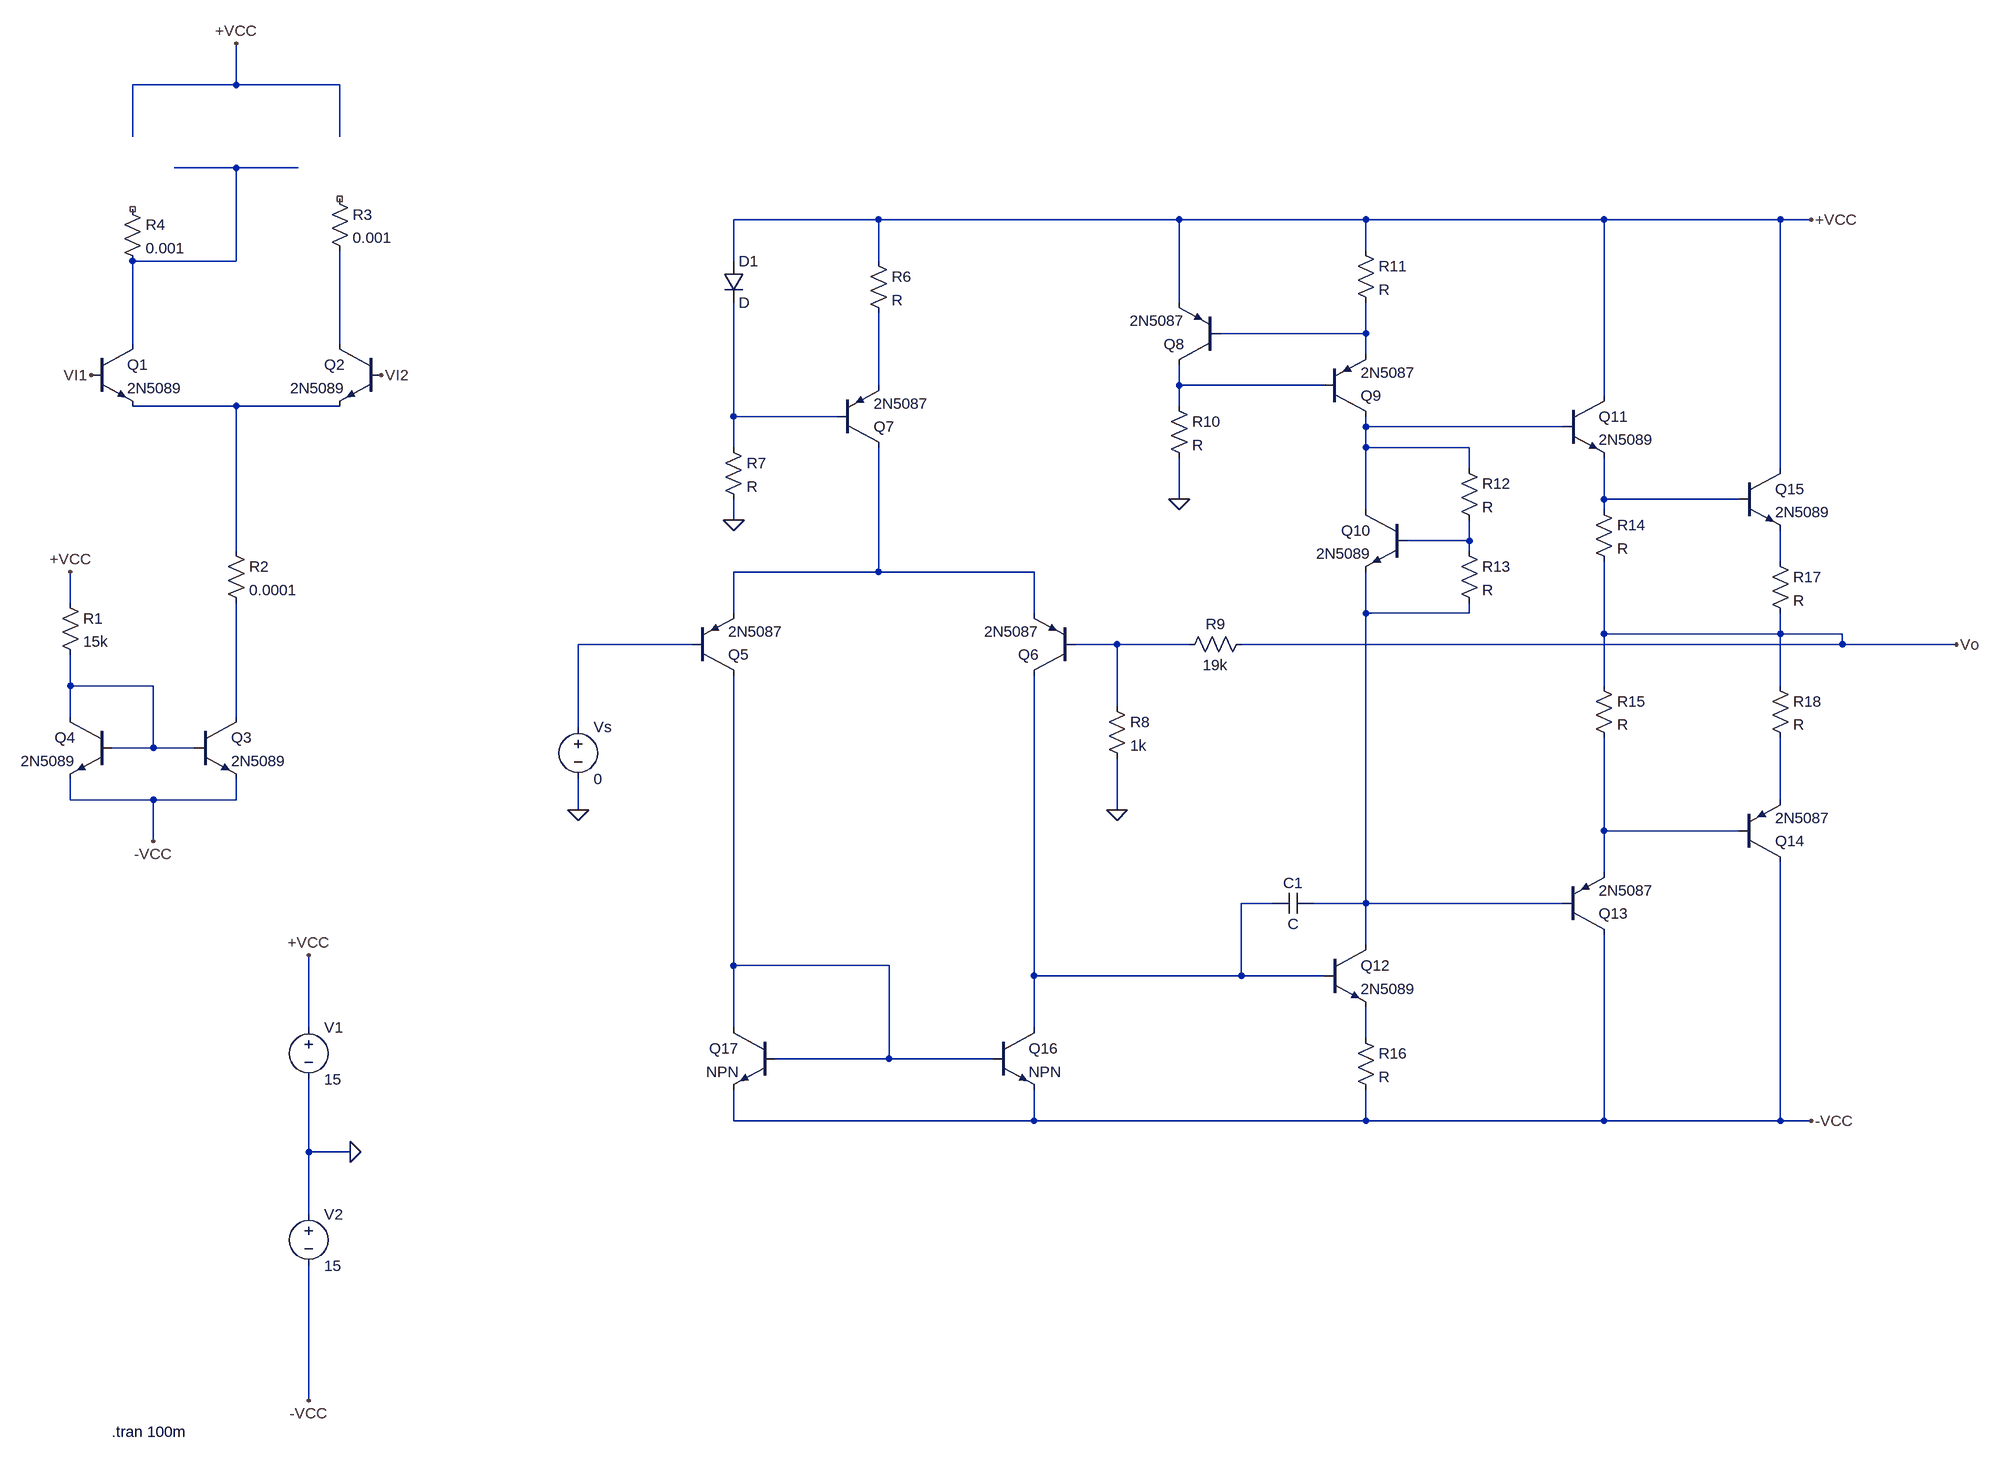
[diagram p0: schematic AmplificadorOperacionalCompleto.asc]
AmplificadorOperacionalCompleto.asc, the LTspice schematic file:
Version 4.1
SHEET 1 4688 1396
WIRE 1072 -736 1072 -800
WIRE 1072 -736 912 -736
WIRE 1232 -736 1072 -736
WIRE 912 -656 912 -736
WIRE 1232 -656 1232 -736
WIRE 1072 -608 976 -608
WIRE 1168 -608 1072 -608
WIRE 2064 -528 1840 -528
WIRE 2528 -528 2064 -528
WIRE 2816 -528 2528 -528
WIRE 3184 -528 2816 -528
WIRE 3456 -528 3184 -528
WIRE 3504 -528 3456 -528
WIRE 2816 -480 2816 -528
WIRE 1072 -464 1072 -608
WIRE 1072 -464 912 -464
WIRE 1840 -464 1840 -528
WIRE 2064 -464 2064 -528
WIRE 2528 -400 2528 -528
WIRE 2816 -352 2816 -400
WIRE 2816 -352 2592 -352
WIRE 912 -336 912 -464
WIRE 1232 -336 1232 -480
WIRE 2816 -320 2816 -352
WIRE 2064 -272 2064 -384
WIRE 2528 -272 2528 -304
WIRE 2752 -272 2528 -272
WIRE 3184 -256 3184 -528
WIRE 1072 -240 912 -240
WIRE 1232 -240 1072 -240
WIRE 2528 -240 2528 -272
WIRE 1840 -224 1840 -400
WIRE 2000 -224 1840 -224
WIRE 2816 -208 2816 -224
WIRE 3120 -208 2816 -208
WIRE 1840 -176 1840 -224
WIRE 2816 -176 2816 -208
WIRE 2976 -176 2816 -176
WIRE 2976 -144 2976 -176
WIRE 3456 -144 3456 -528
WIRE 2528 -96 2528 -160
WIRE 3184 -96 3184 -160
WIRE 3392 -96 3184 -96
WIRE 2816 -80 2816 -176
WIRE 3184 -80 3184 -96
WIRE 1840 -64 1840 -96
WIRE 2976 -32 2976 -64
WIRE 2976 -32 2880 -32
WIRE 1072 -16 1072 -240
WIRE 2976 -16 2976 -32
WIRE 3456 0 3456 -48
WIRE 2064 16 2064 -176
WIRE 2064 16 1840 16
WIRE 2304 16 2064 16
WIRE 816 64 816 16
WIRE 1840 80 1840 16
WIRE 2304 80 2304 16
WIRE 2816 80 2816 16
WIRE 2976 80 2976 64
WIRE 2976 80 2816 80
WIRE 3184 112 3184 0
WIRE 3456 112 3456 80
WIRE 3456 112 3184 112
WIRE 3552 112 3456 112
WIRE 1776 128 1600 128
WIRE 2432 128 2368 128
WIRE 2544 128 2432 128
WIRE 3552 128 3552 112
WIRE 3552 128 2624 128
WIRE 3728 128 3552 128
WIRE 816 192 816 144
WIRE 944 192 816 192
WIRE 3184 192 3184 112
WIRE 3456 192 3456 112
WIRE 2432 224 2432 128
WIRE 816 240 816 192
WIRE 1072 240 1072 64
WIRE 1600 256 1600 128
WIRE 944 288 944 192
WIRE 944 288 880 288
WIRE 1008 288 944 288
WIRE 816 368 816 336
WIRE 944 368 816 368
WIRE 1072 368 1072 336
WIRE 1072 368 944 368
WIRE 3456 368 3456 272
WIRE 1600 384 1600 336
WIRE 2432 384 2432 304
WIRE 3184 416 3184 272
WIRE 3392 416 3184 416
WIRE 944 432 944 368
WIRE 3184 480 3184 416
WIRE 2672 528 2624 528
WIRE 2816 528 2816 80
WIRE 2816 528 2736 528
WIRE 3120 528 2816 528
WIRE 2816 592 2816 528
WIRE 1840 624 1840 176
WIRE 2080 624 1840 624
WIRE 2304 640 2304 176
WIRE 2624 640 2624 528
WIRE 2624 640 2304 640
WIRE 2752 640 2624 640
WIRE 1184 720 1184 608
WIRE 1840 720 1840 624
WIRE 2304 720 2304 640
WIRE 2816 736 2816 688
WIRE 2080 768 2080 624
WIRE 2080 768 1904 768
WIRE 2240 768 2080 768
WIRE 1840 864 1840 816
WIRE 2304 864 2304 816
WIRE 2304 864 1840 864
WIRE 2816 864 2816 816
WIRE 2816 864 2304 864
WIRE 3184 864 3184 576
WIRE 3184 864 2816 864
WIRE 3456 864 3456 464
WIRE 3456 864 3184 864
WIRE 3504 864 3456 864
WIRE 1184 912 1184 800
WIRE 1248 912 1184 912
WIRE 1184 1008 1184 912
WIRE 1184 1296 1184 1088
FLAG 1184 608 +VCC
FLAG 1184 1296 -VCC
FLAG 816 16 +VCC
FLAG 944 432 -VCC
FLAG 1072 -800 +VCC
FLAG 848 -288 VI1
FLAG 1296 -288 VI2
FLAG 1248 912 0
FLAG 1840 -64 0
FLAG 1600 384 0
FLAG 2432 384 0
FLAG 2528 -96 0
FLAG 3504 864 -VCC
FLAG 3504 -528 +VCC
FLAG 3728 128 Vo
SYMBOL voltage 1184 704 R0
WINDOW 123 0 0 Left 0
WINDOW 39 0 0 Left 0
SYMATTR InstName V1
SYMATTR Value 15
SYMBOL voltage 1184 992 R0
WINDOW 123 0 0 Left 0
WINDOW 39 0 0 Left 0
SYMATTR InstName V2
SYMATTR Value 15
SYMBOL npn 848 -336 R0
SYMATTR InstName Q1
SYMATTR Value 2N5089
SYMBOL npn 1296 -336 M0
SYMATTR InstName Q2
SYMATTR Value 2N5089
SYMBOL npn 1008 240 R0
SYMATTR InstName Q3
SYMATTR Value 2N5089
SYMBOL npn 880 240 M0
SYMATTR InstName Q4
SYMATTR Value 2N5089
SYMBOL res 800 48 R0
SYMATTR InstName R1
SYMATTR Value 15k
SYMBOL pnp 1776 176 M180
SYMATTR InstName Q5
SYMATTR Value 2N5087
SYMBOL pnp 2368 176 R180
SYMATTR InstName Q6
SYMATTR Value 2N5087
SYMBOL res 1056 -32 R0
SYMATTR InstName R2
SYMATTR Value 0.0001
SYMBOL res 1216 -576 R0
SYMATTR InstName R3
SYMATTR Value 0.001
SYMBOL res 896 -560 R0
SYMATTR InstName R4
SYMATTR Value 0.001
SYMBOL voltage 1600 240 R0
SYMATTR InstName Vs
SYMATTR Value 0
SYMBOL pnp 2000 -176 M180
SYMATTR InstName Q7
SYMATTR Value 2N5087
SYMBOL res 2048 -480 R0
SYMATTR InstName R6
SYMBOL res 1824 -192 R0
SYMATTR InstName R7
SYMBOL res 2416 208 R0
SYMATTR InstName R8
SYMATTR Value 1k
SYMBOL res 2640 112 R90
WINDOW 0 0 56 VBottom 2
WINDOW 3 32 56 VTop 2
SYMATTR InstName R9
SYMATTR Value 19k
SYMBOL pnp 2592 -304 R180
SYMATTR InstName Q8
SYMATTR Value 2N5087
SYMBOL res 2512 -256 R0
SYMATTR InstName R10
SYMBOL res 2800 -496 R0
SYMATTR InstName R11
SYMBOL pnp 2752 -224 M180
SYMATTR InstName Q9
SYMATTR Value 2N5087
SYMBOL npn 2880 -80 M0
SYMATTR InstName Q10
SYMATTR Value 2N5089
SYMBOL res 2960 -160 R0
SYMATTR InstName R12
SYMBOL res 2960 -32 R0
SYMATTR InstName R13
SYMBOL npn 3120 -256 R0
SYMATTR InstName Q11
SYMATTR Value 2N5089
SYMBOL res 3168 -96 R0
SYMATTR InstName R14
SYMBOL res 3168 176 R0
SYMATTR InstName R15
SYMBOL npn 2752 592 R0
SYMATTR InstName Q12
SYMATTR Value 2N5089
SYMBOL cap 2736 512 R90
WINDOW 0 0 32 VBottom 2
WINDOW 3 32 32 VTop 2
SYMATTR InstName C1
SYMBOL res 2800 720 R0
SYMATTR InstName R16
SYMBOL pnp 3120 576 M180
SYMATTR InstName Q13
SYMATTR Value 2N5087
SYMBOL pnp 3392 464 M180
SYMATTR InstName Q14
SYMATTR Value 2N5087
SYMBOL npn 3392 -144 R0
SYMATTR InstName Q15
SYMATTR Value 2N5089
SYMBOL res 3440 -16 R0
SYMATTR InstName R17
SYMBOL res 3440 176 R0
SYMATTR InstName R18
SYMBOL diode 1824 -464 R0
SYMATTR InstName D1
SYMBOL npn 2240 720 R0
SYMATTR InstName Q16
SYMBOL npn 1904 720 M0
SYMATTR InstName Q17
TEXT 880 1344 Left 2 !.tran 100m

The netlist it stands for:
* AmplificadorOperacionalCompleto.asc
V1 +VCC 0 15
V2 0 -VCC 15
Q1 N001 VI1 N006 0 2N5089
Q2 N003 VI2 N006 0 2N5089
Q3 N017 N016 -VCC 0 2N5089
Q4 N016 N016 -VCC 0 2N5089
R1 +VCC N016 15k
Q5 N021 N014 N012 0 2N5087
Q6 N020 N015 N012 0 2N5087
R2 N006 N017 0.0001
R3 NC_01 N003 0.001
R4 NC_02 N001 0.001
Vs N014 0 0
Q7 N012 N007 N004 0 2N5087
R6 +VCC N004 R
R7 N007 0 R
R8 N015 0 1k
R9 Vo N015 19k
Q8 N005 N002 +VCC 0 2N5087
R10 N005 0 R
R11 +VCC N002 R
Q9 N008 N005 N002 0 2N5087
Q10 N008 N010 N013 0 2N5089
R12 N008 N010 R
R13 N010 N013 R
Q11 +VCC N008 N009 0 2N5089
R14 N009 Vo R
R15 Vo N019 R
Q12 N013 N020 N022 0 2N5089
C1 N013 N020 C
R16 N022 -VCC R
Q13 -VCC N013 N019 0 2N5087
Q14 -VCC N019 N018 0 2N5087
Q15 +VCC N009 N011 0 2N5089
R17 N011 Vo R
R18 Vo N018 R
D1 +VCC N007 D
Q16 N020 N021 -VCC 0 NPN
Q17 N021 N021 -VCC 0 NPN
.model D D
.lib standard.dio
.model NPN NPN
.model PNP PNP
.lib standard.bjt
.tran 100m
.backanno
.end